# Altium schematic sheet hau1906.SchDoc
size A
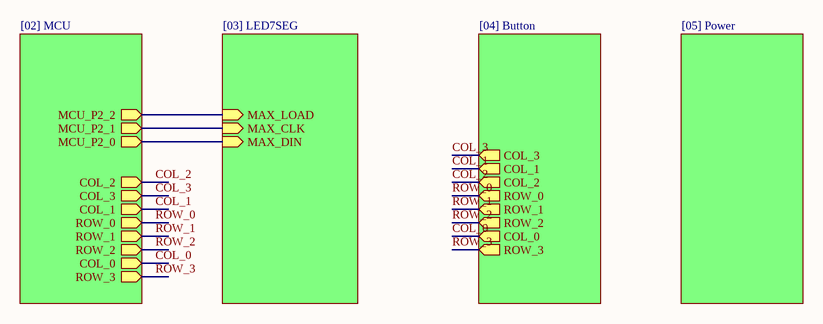
[diagram p0: hau1906.SchDoc]

## Sub-sheets
02 = [02] MCU: MCU_P2_0 (out), MCU_P2_1 (out), MCU_P2_2 (out), COL_2 (out), COL_3 (out), COL_1 (out), ROW_0 (out), ROW_1 (out), ROW_2 (out), COL_0 (out), ROW_3 (out)
03 = [03] LED7SEG: MAX_LOAD (in), MAX_CLK (in), MAX_DIN (in)
04 = [04] Button: COL_3 (out), COL_1 (out), COL_2 (out), ROW_0 (out), ROW_1 (out), ROW_2 (out), COL_0 (out), ROW_3 (out)
05 = [05] Power: no entries

## Nets
COL_0: sheet 02/COL_0, sheet 04/COL_0
COL_1: sheet 02/COL_1, sheet 04/COL_1
COL_2: sheet 02/COL_2, sheet 04/COL_2
COL_3: sheet 02/COL_3, sheet 04/COL_3
ROW_0: sheet 02/ROW_0, sheet 04/ROW_0
ROW_1: sheet 02/ROW_1, sheet 04/ROW_1
ROW_2: sheet 02/ROW_2, sheet 04/ROW_2
ROW_3: sheet 02/ROW_3, sheet 04/ROW_3
(unnamed): sheet 02/MCU_P2_0, sheet 03/MAX_DIN
(unnamed): sheet 02/MCU_P2_1, sheet 03/MAX_CLK
(unnamed): sheet 02/MCU_P2_2, sheet 03/MAX_LOAD